# EAGLE design ledcube (EAGLE 6.5.0)
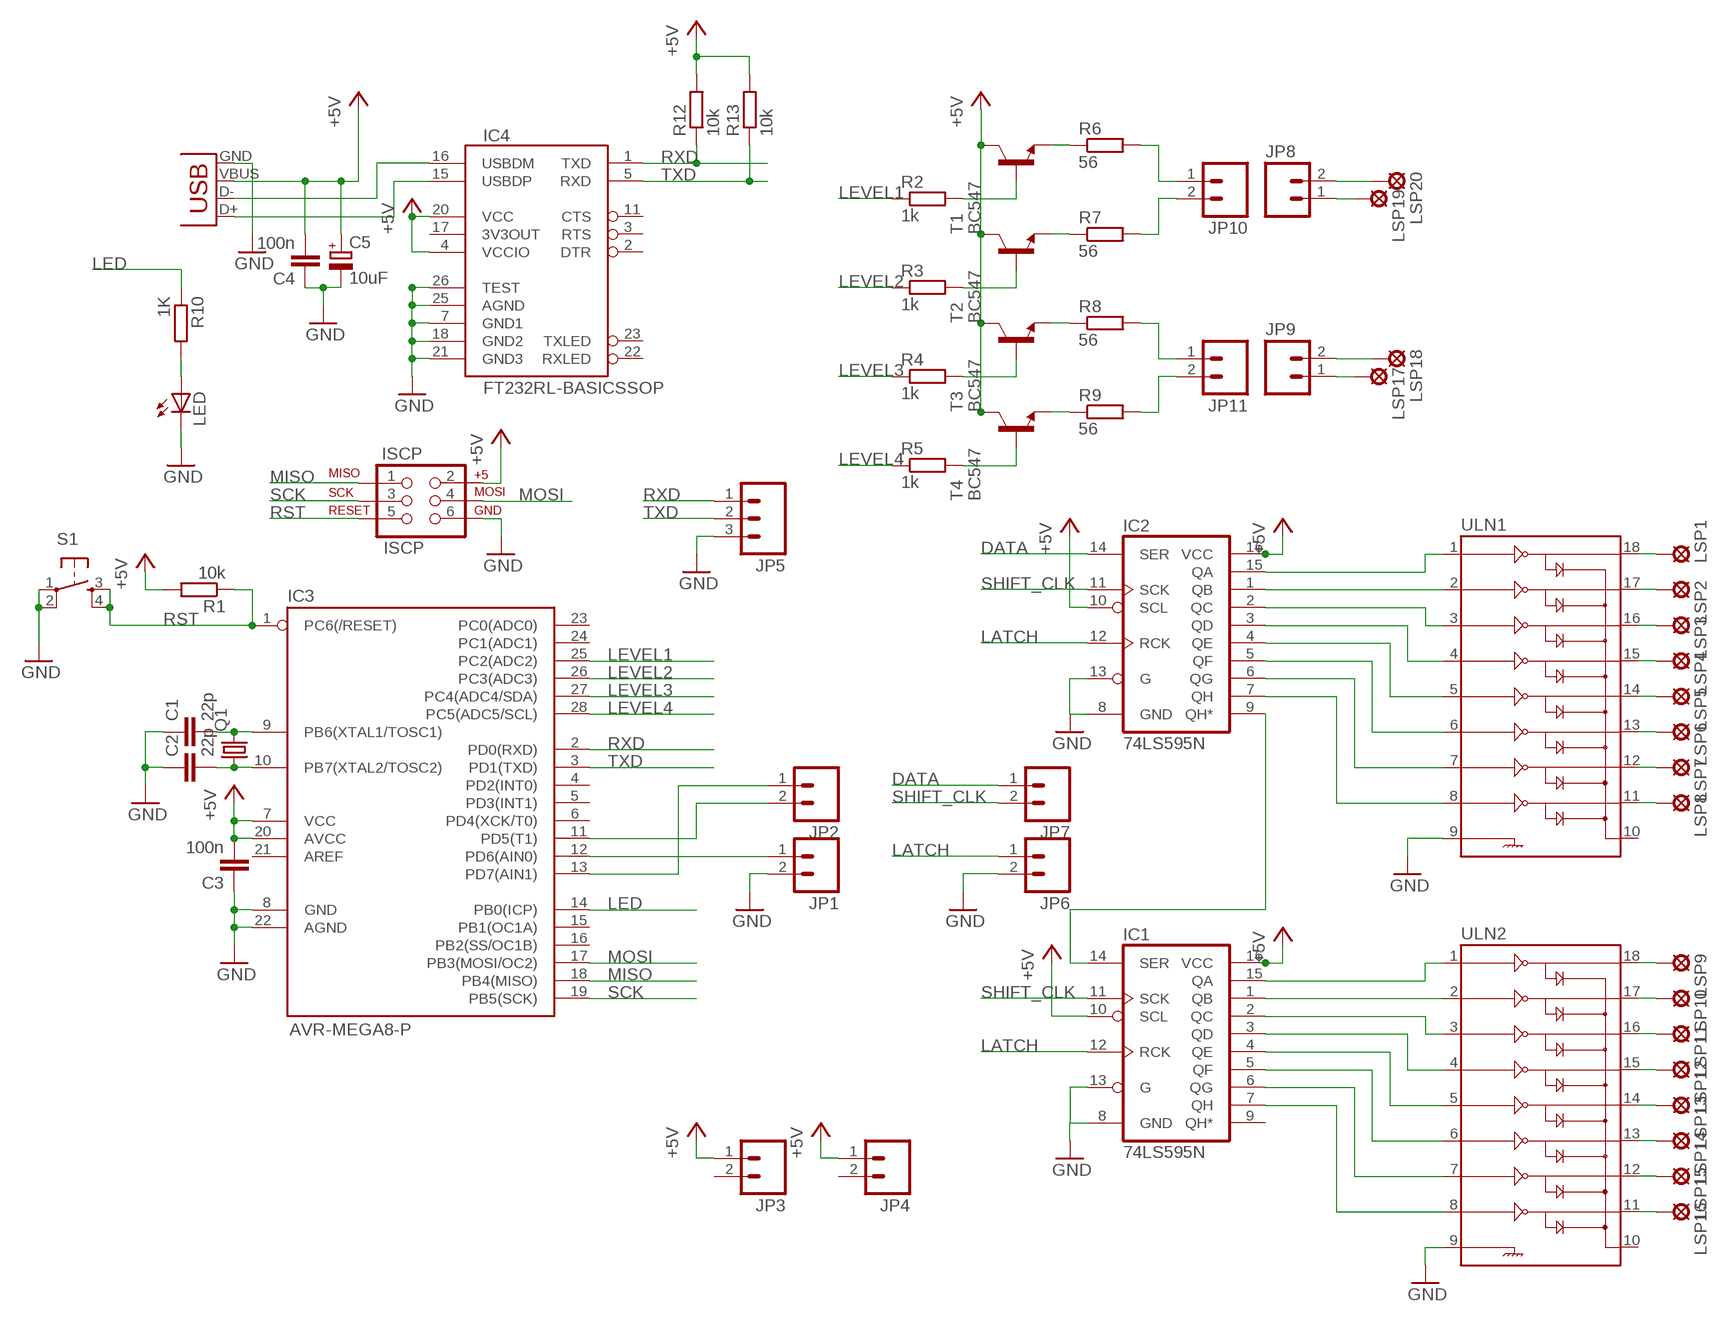
[diagram p0: schematic, sheet 1]

## Parts
C1  22p  C-EU050-024X044  [C050-024X044]
C2  22p  C-EU050-024X044  [C050-024X044]
C3  100n  C-EU050-024X044  [C050-024X044]
C4  100n  C-EU050-024X044  [C050-024X044]
C5  10uF  CPOL-EUE2.5-6  [E2,5-6]
IC1  74LS595N  [DIL16]
IC2  74LS595N  [DIL16]
IC3  AVR-MEGA8-P  [DIL28-3]
IC4  FT232RL-BASICSSOP  [SSOP28DB]
ISCP  ISCP  AVR_SPI_PRG_6NS  [2X3-NS]
JP1  M02PTH3  [1X02_LONGPADS]
JP2  M02PTH3  [1X02_LONGPADS]
JP3  M02PTH3  [1X02_LONGPADS]
JP4  M02PTH3  [1X02_LONGPADS]
JP5  M03PTH  [1X03]
JP6  M02PTH3  [1X02_LONGPADS]
JP7  M02PTH3  [1X02_LONGPADS]
JP8  M02PTH3  [1X02_LONGPADS]
JP9  M02PTH3  [1X02_LONGPADS]
JP10  M02PTH3  [1X02_LONGPADS]
JP11  M02PTH3  [1X02_LONGPADS]
LED  LED3MM  [LED3MM]
LSP1  LSP10  [LSP10]
LSP2  LSP10  [LSP10]
LSP3  LSP10  [LSP10]
LSP4  LSP10  [LSP10]
LSP5  LSP10  [LSP10]
LSP6  LSP10  [LSP10]
LSP7  LSP10  [LSP10]
LSP8  LSP10  [LSP10]
LSP9  LSP10  [LSP10]
LSP10  LSP10  [LSP10]
LSP11  LSP10  [LSP10]
LSP12  LSP10  [LSP10]
LSP13  LSP10  [LSP10]
LSP14  LSP10  [LSP10]
LSP15  LSP10  [LSP10]
LSP16  LSP10  [LSP10]
LSP17  LSP10  [LSP10]
LSP18  LSP10  [LSP10]
LSP19  LSP10  [LSP10]
LSP20  LSP10  [LSP10]
Q1  CRYSTALHC49S  [HC49/S]
R1  10k  R-EU_0204/2V  [0204V]
R2  1k  R-EU_0204/2V  [0204V]
R3  1k  R-EU_0204/2V  [0204V]
R4  1k  R-EU_0204/2V  [0204V]
R5  1k  R-EU_0204/2V  [0204V]
R6  56  R-EU_0204/2V  [0204V]
R7  56  R-EU_0204/2V  [0204V]
R8  56  R-EU_0204/2V  [0204V]
R9  56  R-EU_0204/2V  [0204V]
R10  1K  R-EU_0204/2V  [0204V]
R12  10k  R-EU_0204/2V  [0204V]
R13  10k  R-EU_0204/2V  [0204V]
S1  TAC_SWITCHPTH  [TACTILE-PTH]
T1  BC547  [TO92]
T2  BC547  [TO92]
T3  BC547  [TO92]
T4  BC547  [TO92]
ULN1  ULN2803DIP  [DIL18]
ULN2  ULN2803DIP  [DIL18]
X1  USBSMD  [USB-MINIB]

## Nets
+5V: C3.2 C4.2 C5.+ IC1.10(SCL) IC1.16(VCC) IC2.10(SCL) IC2.16(VCC) IC3.7(VCC) IC3.20(AVCC) IC4.4(VCCIO) IC4.20(VCC) ISCP.2 JP3.1 JP4.1 R1.2 R12.2 R13.2 T1.3(C) T2.3(C) T3.3(C) T4.3(C) X1.VBUS
DATA: IC2.14(SER) JP7.1
GND: C1.1 C2.1 C3.1 C4.1 C5.- IC1.8(GND) IC1.13(G) IC2.8(GND) IC2.13(G) IC3.8(GND) IC3.22(AGND) IC4.7(GND1) IC4.18(GND2) IC4.21(GND3) IC4.25(AGND) IC4.26(TEST) ISCP.6 JP1.2 JP5.3 JP6.2 LED.K(C) S1.1 S1.2 ULN1.9 ULN2.9 X1.GND
LATCH: IC1.12(RCK) IC2.12(RCK) JP6.1
LED: IC3.14(PB0(ICP)) R10.1
LEVEL1: IC3.25(PC2(ADC2)) R2.1
LEVEL2: IC3.26(PC3(ADC3)) R3.1
LEVEL3: IC3.27(PC4(ADC4/SDA)) R4.1
LEVEL4: IC3.28(PC5(ADC5/SCL)) R5.1
MISO: IC3.18(PB4(MISO)) ISCP.1
MOSI: IC3.17(PB3(MOSI/OC2)) ISCP.4
N$1: R6.1 T1.1(E)
N$2: R7.1 T2.1(E)
N$3: R8.1 T3.1(E)
N$4: R9.1 T4.1(E)
N$5: R5.2 T4.2(B)
N$6: R4.2 T3.2(B)
N$7: R3.2 T2.2(B)
N$8: R2.2 T1.2(B)
N$9: C2.2 IC3.10(PB7(XTAL2/TOSC2)) Q1.1
N$10: C1.2 IC3.9(PB6(XTAL1/TOSC1)) Q1.2
N$11: JP10.1 R6.2
N$12: IC4.16(USBDM) X1.D-
N$13: IC4.15(USBDP) X1.D+
N$14: IC1.15(QA) ULN2.1
N$15: IC1.1(QB) ULN2.2
N$16: IC1.2(QC) ULN2.3
N$17: IC1.3(QD) ULN2.4
N$18: IC1.4(QE) ULN2.5
N$19: IC1.5(QF) ULN2.6
N$20: IC1.6(QG) ULN2.7
N$21: IC1.7(QH) ULN2.8
N$22: IC2.15(QA) ULN1.1
N$23: IC2.1(QB) ULN1.2
N$24: IC2.2(QC) ULN1.3
N$25: IC2.3(QD) ULN1.4
N$26: IC2.4(QE) ULN1.5
N$27: IC2.5(QF) ULN1.6
N$28: IC2.6(QG) ULN1.7
N$29: IC2.7(QH) ULN1.8
N$30: JP9.1 LSP17.MP
N$31: JP11.1 R8.2
N$32: JP11.2 R9.2
N$33: IC3.11(PD5(T1)) JP2.2
N$34: IC3.12(PD6(AIN0)) JP1.1
N$35: IC3.13(PD7(AIN1)) JP2.1
N$36: JP10.2 R7.2
N$37: JP9.2 LSP18.MP
N$38: JP8.1 LSP19.MP
N$39: JP8.2 LSP20.MP
N$41: LSP16.MP ULN2.11
N$42: LSP15.MP ULN2.12
N$43: LSP14.MP ULN2.13
N$44: LSP13.MP ULN2.14
N$45: LSP12.MP ULN2.15
N$46: LSP11.MP ULN2.16
N$47: LSP10.MP ULN2.17
N$48: LSP9.MP ULN2.18
N$49: IC1.14(SER) IC2.9(QH*)
N$50: LED.A R10.2
N$55: LSP8.MP ULN1.11
N$56: LSP1.MP ULN1.18
N$57: LSP7.MP ULN1.12
N$58: LSP6.MP ULN1.13
N$59: LSP5.MP ULN1.14
N$60: LSP4.MP ULN1.15
N$61: LSP3.MP ULN1.16
N$62: LSP2.MP ULN1.17
RST: IC3.1(PC6(/RESET)) ISCP.5 R1.1 S1.3 S1.4
RXD: IC3.2(PD0(RXD)) IC4.1(TXD) JP5.1 R12.1
SCK: IC3.19(PB5(SCK)) ISCP.3
SHIFT_CLK: IC1.11(SCK) IC2.11(SCK) JP7.2
TXD: IC3.3(PD1(TXD)) IC4.5(RXD) JP5.2 R13.1
Unconnected: IC1.9(QH*) IC3.4(PD2(INT0)) IC3.5(PD3(INT1)) IC3.6(PD4(XCK/T0)) IC3.15(PB1(OC1A)) IC3.16(PB2(SS/OC1B)) IC3.21(AREF) IC3.23(PC0(ADC0)) IC3.24(PC1(ADC1)) IC4.2(DTR) IC4.3(RTS) IC4.11(CTS) IC4.17(3V3OUT) IC4.22(RXLED) IC4.23(TXLED) JP3.2 JP4.2 ULN1.10 ULN2.10

## Library data of the parts
C1-C4 = rcl:C-EU: CAPACITOR, European symbol
C5 = rcl:CPOL-EU: POLARIZED CAPACITOR, European symbol
IC1 IC2 = SparkFun:74*595: 8-bit SHIFT REGISTER, output latch
IC3 = SparkFun:AVR-MEGA8-P: MICROCONTROLLER 8 Kbytes FLASH 1 kbytes SRAM 512 bytes EEPROM USART 4-channel 10 bit ADC 2-channel 8 bit ADC
IC4 = SparkFun:FT232RL-BASIC: USB UART This is the simplified version of the FT232RL unit. Only what you need, nothing you don't. Spark Fun Electronics SKU : COM-00650
ISCP = SparkFun:AVR_SPI_PRG_6: AVR ISP 6 Pin This is the reduced ISP connector for AVR programming. Common on Arduino. This footprint will take up less PCB space and can be used with a 10-pin to 6-pin adapter such as SKU: BOB-08508
JP1-JP4 JP6-JP11 = SparkFun:M02: Header 2 Standard 2-pin 0.1" header. Use with straight break away headers (SKU : PRT-00116), right angle break away headers (PRT-00553), swiss pins (PRT-00743), machine pins (PRT-00117), and female headers (PRT-00115). Molex polarized connector foot print use with SKU : PRT-08233 with associated crimp pins and housings.
JP5 = SparkFun:M03: Header 3 Standard 3-pin 0.1" header. Use with straight break away headers (SKU : PRT-00116), right angle break away headers (PRT-00553), swiss pins (PRT-00743), machine pins (PRT-00117), and female headers (PRT-00115). Molex polarized connector foot print use with SKU : PRT-08232 with associated crimp pins and housings.
LED = led:LED: LED OSRAM: - CHIPLED LG R971, LG N971, LY N971, LG Q971, LY Q971, LO R971, LY R971 LH N974, LH R974 LS Q976, LO Q976, LY Q976 LO Q996 - Hyper CHIPLED LW Q18S LB Q993, LB Q99A, LB R99A - SideLED LS A670, LO A670, LY A670, LG A670, LP A670 LB A673, LV A673, LT A673, LW A673 LH A674 LY A675 LS A676, LA A676, LO A676, LY A676, LW A676 LS A679, LY A679, LG A679 - Hyper Micro SIDELED® LS Y876, LA Y876, LO Y876, LY Y876 LT Y87S - SmartLED LW L88C, LW L88S LB L89C, LB L89S, LG L890 LS L89K, LO L89K, LY L89K LS L896, LA L896, LO L896, LY L896 - TOPLED LS T670, LO T670, LY T670, LG T670, LP T670 LSG T670, LSP T670, LSY T670, LOP T670, LYG T670 LG T671, LOG T671, LSG T671 LB T673, LV T673, LT T673, LW T673 LH T674 LS T676, LA T676, LO T676, LY T676, LB T676, LH T676, LSB T676, LW T676 LB T67C, LV T67C, LT T67C, LS T67K, LO T67K, LY T67K, LW E67C LS E67B, LA E67B, LO E67B, LY E67B, LB E67C, LV E67C, LT E67C LW T67C LS T679, LY T679, LG T679 LS T770, LO T770, LY T770, LG T770, LP T770 LB T773, LV T773, LT T773, LW T773 LH T774 LS E675, LA E675, LY E675, LS T675 LS T776, LA T776, LO T776, LY T776, LB T776 LHGB T686 LT T68C, LB T68C - Hyper Mini TOPLED® LB M676 - Mini TOPLED Santana® LG M470 LS M47K, LO M47K, LY M47K Source: http://www.osram.convergy.de - LUMILED® LXK2-PW12-R00, LXK2-PW12-S00, LXK2-PW14-U00, LXK2-PW14-V00 LXK2-PM12-R00, LXK2-PM12-S00, LXK2-PM14-U00 LXK2-PE12-Q00, LXK2-PE12-R00, LXK2-PE12-S00, LXK2-PE14-T00, LXK2-PE14-U00 LXK2-PB12-K00, LXK2-PB12-L00, LXK2-PB12-M00, LXK2-PB14-N00, LXK2-PB14-P00, LXK2-PB14-Q00 LXK2-PR12-L00, LXK2-PR12-M00, LXK2-PR14-Q00, LXK2-PR14-R00 LXK2-PD12-Q00, LXK2-PD12-R00, LXK2-PD12-S00 LXK2-PH12-R00, LXK2-PH12-S00 LXK2-PL12-P00, LXK2-PL12-Q00, LXK2-PL12-R00 Source: www.luxeon.com
LSP1-LSP20 = solpad:LSP10: SOLDER PAD drill 1.0 mm, distributor Buerklin, 12H555
Q1 = crystal:CRYSTAL: CRYSTAL
R1-R10 R12 R13 = rcl:R-EU_: RESISTOR, European symbol
S1 = SparkFun:TAC_SWITCH: Momentary Switch Button commonly used for reset or general input. Spark Fun Electronics SKU : COM-00097
T1-T4 = transistor:BC547: NPN TRANSISTOR
ULN1 ULN2 = SparkFun:ULN2803: Darlington Driver ULN2803 Darlington array. 500mA max per channel, 8-channel package. Spark Fun Electronics SKU : COM-00312
X1 = SparkFun:USB: USB Connectors USB-B-PTH is fully proven SKU : PRT-00139 USB-miniB is fully proven SKU : PRT-00587 USB-A-PCB is untested. USB-A-H is throughly reviewed, but untested. Spark Fun Electronics SKU : PRT-00437 USB-B-SMT is throughly reviewed, but untested. Needs silkscreen touching up. USB-A-S has not been used/tested USB-MB-H has not been used/tested

## Board
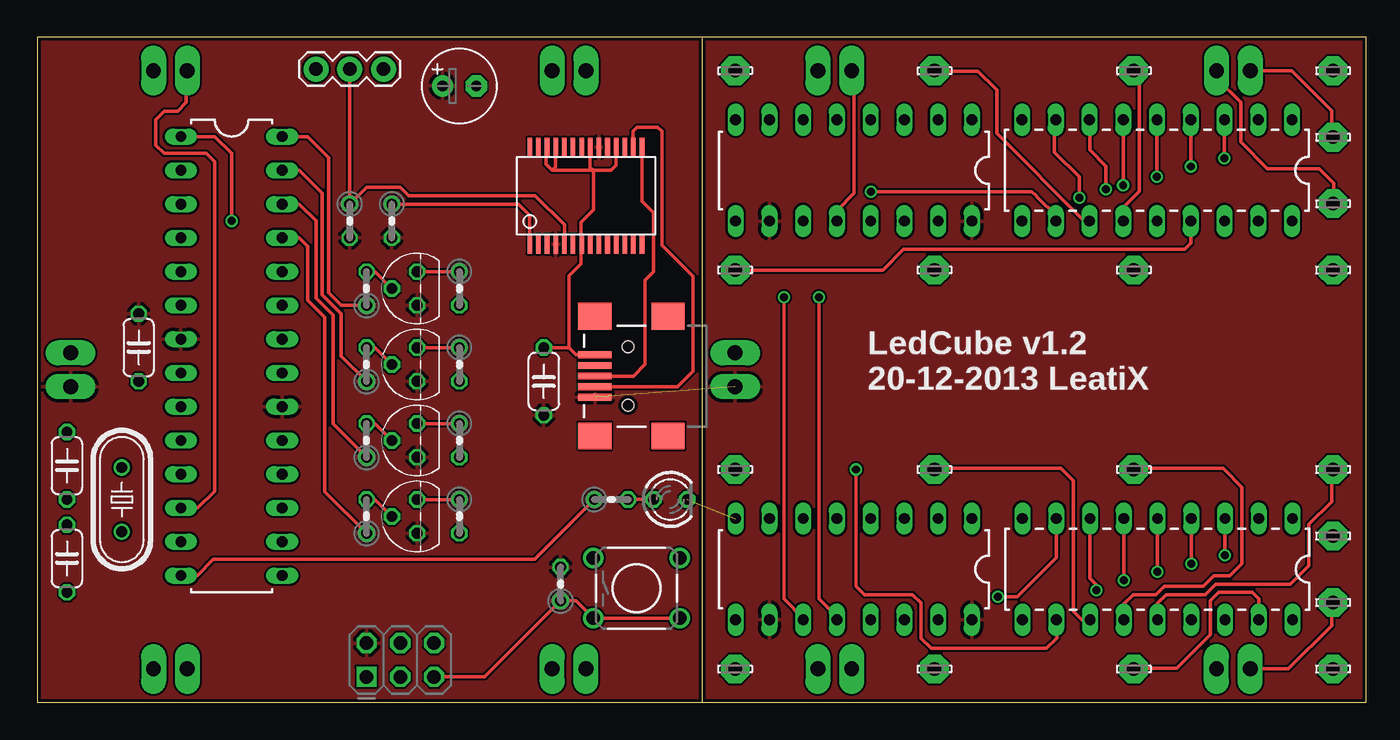
[diagram p1: board, top side]
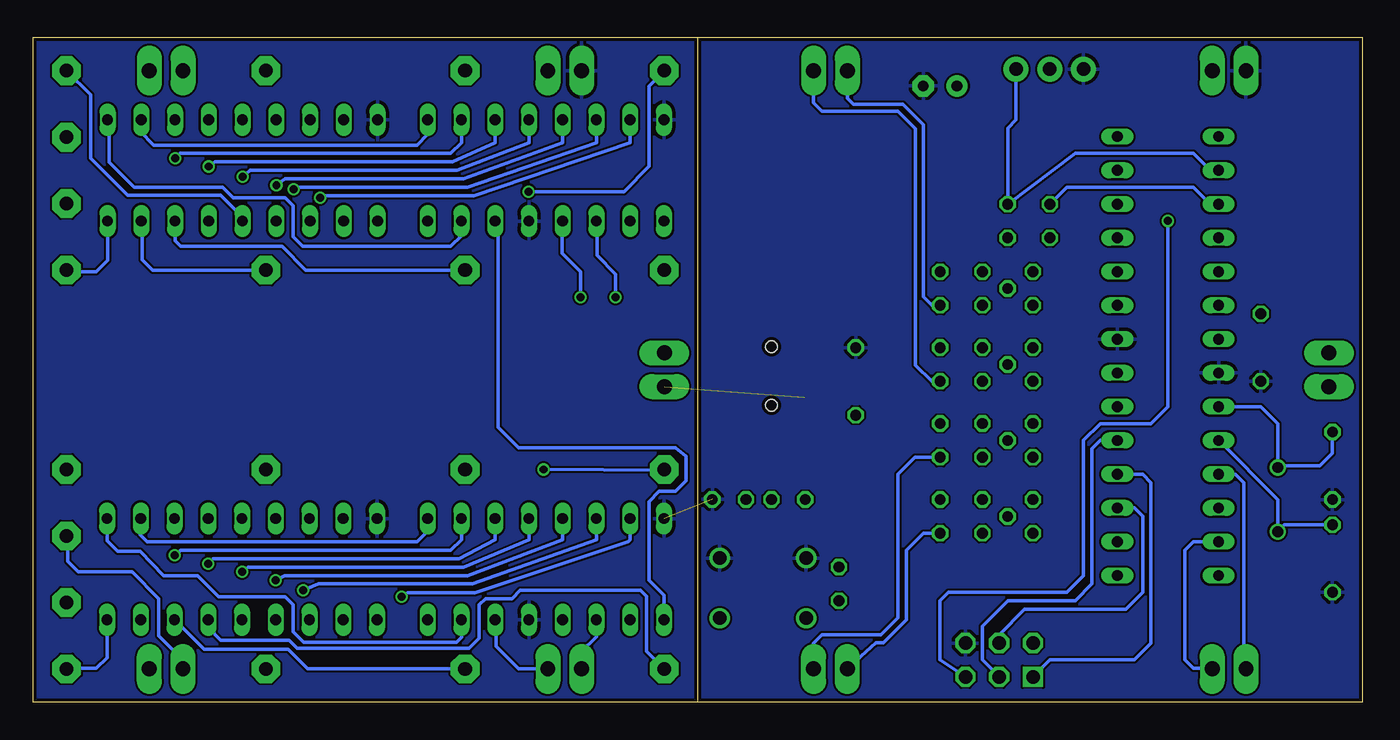
[diagram p2: board, bottom side, seen from below]

Size 100 x 50 mm. Coordinates in mm from the lower left corner, seen from the top.
Outline: 50,0 0,0 0,50 50,50
Outline: 50,0 100,0 100,50 50,50
Outline: 50,50 50,0
Copper layers (1*2*15*16): Top 0.035mm / dielectric 0.2mm / Route2 0.0175mm / dielectric 1.1mm / Route15 0.0175mm / dielectric 0.2mm / Bottom 0.035mm
Design rules "SeeedStudio_DRU_no_angle_20130527": minimum track width 6mil, minimum drill 12mil, track to track 6mil, track to pad 6mil, pad to pad 6mil, via to via 6mil, smd to smd 0mil, copper to edge 10mil, drill to drill 10mil, minimum pad ring 6mil, minimum via ring 6mil, stop-mask expansion 2mil, vias tented up to drill 25mil, thermal gap 10mil

### Footprints (pad centres in the part's own frame; a part is rotated, then mirrored left to right if it is on the bottom)
C050-024X044 = drill 0.813 octagon: 1 -2.54,0; 2 2.54,0
E2,5-6 = drill 0.813 pad 1.6: + -1.27,0 | drill 0.813 pad 1.6 octagon: - 1.27,0
DIL16 = drill 0.813 long: 1 -8.89,-3.81; 2 -6.35,-3.81; 3 -3.81,-3.81; 4 -1.27,-3.81; 5 1.27,-3.81; 6 3.81,-3.81; 7 6.35,-3.81; 8 8.89,-3.81; 9 8.89,3.81; 10 6.35,3.81; 11 3.81,3.81; 12 1.27,3.81; 13 -1.27,3.81; 14 -3.81,3.81; 15 -6.35,3.81; 16 -8.89,3.81
DIL28-3 = drill 0.813 long: 1 -16.51,-3.81; 2 -13.97,-3.81; 3 -11.43,-3.81; 4 -8.89,-3.81; 5 -6.35,-3.81; 6 -3.81,-3.81; 7 -1.27,-3.81; 8 1.27,-3.81; 9 3.81,-3.81; 10 6.35,-3.81; 11 8.89,-3.81; 12 11.43,-3.81; 13 13.97,-3.81; 14 16.51,-3.81; 15 16.51,3.81; 16 13.97,3.81; 17 11.43,3.81; 18 8.89,3.81; 19 6.35,3.81; 20 3.81,3.81; 21 1.27,3.81; 22 -1.27,3.81; 23 -3.81,3.81; 24 -6.35,3.81; 25 -8.89,3.81; 26 -11.43,3.81; 27 -13.97,3.81; 28 -16.51,3.81
SSOP28DB = smd 0.348 x 1.397: 1 -4.225,-3.656; 2 -3.575,-3.656; 3 -2.925,-3.656; 4 -2.275,-3.656; 5 -1.625,-3.656; 6 -0.975,-3.656; 7 -0.325,-3.656; 8 0.325,-3.656; 9 0.975,-3.656; 10 1.625,-3.656; 11 2.275,-3.656; 12 2.925,-3.656; 13 3.575,-3.656; 14 4.225,-3.656; 15 4.225,3.656; 16 3.575,3.656; 17 2.925,3.656; 18 2.275,3.656; 19 1.625,3.656; 20 0.975,3.656; 21 0.325,3.656; 22 -0.325,3.656; 23 -0.975,3.656; 24 -1.625,3.656; 25 -2.275,3.656; 26 -2.925,3.656; 27 -3.575,3.656; 28 -4.225,3.656
2X3-NS = drill 1.016 square: 1 -2.54,-1.27 | drill 1.016 octagon: 2 -2.54,1.27; 3 0,-1.27; 4 0,1.27; 5 2.54,-1.27; 6 2.54,1.27
1X02_LONGPADS = drill 1.118 pad 1.88 long: 1 0,0; 2 2.54,0
1X03 = drill 1.016 pad 1.88: 1 0,0; 2 2.54,0; 3 5.08,0
LED3MM = drill 0.813 octagon: A -1.27,0; K 1.27,0
LSP10 = drill 1.016 pad 2.159 octagon: MP 0,0
HC49/S = drill 0.813: 1 -2.413,0; 2 2.413,0
0204V = drill 0.813 octagon: 1 -1.27,0; 2 1.27,0
TACTILE-PTH = drill 1.016: 1 -3.251,2.261; 2 3.251,2.261; 3 -3.251,-2.261; 4 3.251,-2.261
TO92 = drill 0.813 octagon: 1 1.27,0; 2 0,1.905; 3 -1.27,0
DIL18 = drill 0.813 long: 1 -10.16,-3.81; 2 -7.62,-3.81; 3 -5.08,-3.81; 4 -2.54,-3.81; 5 0,-3.81; 6 2.54,-3.81; 7 5.08,-3.81; 8 7.62,-3.81; 9 10.16,-3.81; 10 10.16,3.81; 11 7.62,3.81; 12 5.08,3.81; 13 2.54,3.81; 14 0,3.81; 15 -2.54,3.81; 16 -5.08,3.81; 17 -7.62,3.81; 18 -10.16,3.81
USB-MINIB = smd 2.5 x 0.5: D+ 2.5,0; D- 2.5,0.8; GND 2.5,-1.6; ID 2.5,-0.8; VBUS 2.5,1.6 | smd 2.5 x 2: GND@1 -3,-4.5; GND@2 -3,4.5; GND@3 2.5,4.5; GND@4 2.5,-4.5 | hole 0.9: 0,2.2; 0,-2.2

### Placement (x,y rotation side)
C1  2.22,17.78 90 top
C2  2.22,10.79 90 top
C3  7.62,26.67 90 top
C4  38.1,24.13 270 top
C5  31.75,46.35 0 top
IC1  61.43,40 180 top
IC2  61.43,10 180 top
IC3  14.61,26.04 270 top
IC4  41.27,38.1 0 top
ISCP  27.3,3.17 0 top
JP1  11.27,47.5 180 top
JP2  11.27,2.5 180 top
JP3  52.5,23.73 90 top
JP4  2.5,23.73 90 top
JP5  26.04,47.62 180 top
JP6  61.27,47.5 180 top
JP7  61.27,2.5 180 top
JP8  88.73,2.5 0 top
JP9  91.27,47.5 180 top
JP10  38.73,2.5 0 top
JP11  41.27,47.5 180 top
LED  47.62,15.25 0 top
LSP1  97.5,2.5 0 top
LSP2  82.5,2.5 0 top
LSP3  67.5,2.5 0 top
LSP4  52.5,2.5 0 top
LSP5  97.5,17.5 0 top
LSP6  82.5,17.5 0 top
LSP7  67.5,17.5 0 top
LSP8  52.5,17.5 0 top
LSP9  97.5,32.5 0 top
LSP10  82.5,32.5 0 top
LSP11  67.5,32.5 0 top
LSP12  52.5,32.5 0 top
LSP13  97.5,47.5 0 top
LSP14  82.5,47.5 0 top
LSP15  67.5,47.5 0 top
LSP16  52.5,47.5 0 top
LSP17  97.5,42.5 0 top
LSP18  97.5,37.5 0 top
LSP19  97.5,12.5 0 top
LSP20  97.5,7.5 0 top
Q1  6.35,15.24 90 top
R1  39.37,8.89 90 top
R2  24.77,13.97 90 top
R3  24.77,19.68 90 top
R4  24.77,25.4 90 top
R5  24.77,31.11 90 top
R6  31.75,13.97 270 top
R7  31.75,19.68 270 top
R8  31.75,25.4 270 top
R9  31.75,31.11 270 top
R10  43.18,15.25 0 top
R12  26.67,36.2 270 top
R13  23.5,36.2 270 top
S1  45.09,8.57 0 top
T1  28.57,13.97 90 top
T2  28.57,19.68 90 top
T3  28.57,25.4 90 top
T4  28.57,31.11 90 top
ULN1  84.29,10 180 top
ULN2  84.25,40 180 top
X1  44.45,24.53 180 top

### Tracks (layer width: path | path; a pad name or v marks a point on that pad's centre or on a via)
+5V  (1 unrouted)
  pour Top: -1.27,50.8 100.33,50.8 100.33,-0.64 -1.27,-0.64
DATA
  Bottom 0.254: JP7.1 63.48,2.5 65.19,4.2 65.19,6.14 IC2.14
GND  (1 unrouted)
  Top 0.254: IC4.18 43.55,40.38 43.18,40.01 41.85,40.01 | 41.85,40.01 38.72,40.01 | 38.72,40.01 38.27,40.45 38.27,41.68 IC4.26 | IC4.25 39,40.29 38.72,40.01 | IC4.21 41.6,40.26 41.85,40.01 | 41.85,40.01 41.85,37.03 40.92,36.09 40.92,34.48 IC4.7 40.92,34.41 40.92,32.98 40.01,32.07 40.01,26.67 | X1.GND 40.55,26.13 40.01,26.67 | C4.1 40.01,26.67
  pour Bottom: -1.27,50.8 100.33,50.8 100.33,-0.64 -1.27,-0.64
LATCH  (via drill 0.6)
  Top 0.254: IC2.12 60.16,6.43 58.81,7.78 v58.81,30.45 | IC1.12 60.16,36.98 61.45,38.27 61.45,47.32 JP6.1
  Bottom 0.254: v58.81,30.45 58.81,32.36 60.21,33.76 60.21,36.14 IC1.12
LED
  Top 0.254: IC3.14 12.01,9.53 13.22,10.73 37.4,10.73 R10.1
LEVEL1
  Top 0.254: IC3.25 19.68,34.92 20.32,34.29 20.32,30.24 21.62,28.94 21.62,15.84 R2.1
LEVEL2
  Top 0.254: IC3.26 19.68,37.47 20.95,36.2 20.95,30.39 22.25,29.09 22.25,20.93 R3.1
LEVEL3
  Top 0.254: IC3.27 19.68,40.01 21.42,38.27 21.42,30.65 22.86,29.21 22.86,26.04 R4.1
LEVEL4
  Top 0.254: IC3.28 20.32,42.55 21.9,40.96 21.9,30.8 22.86,29.84 R5.1
MISO
  Bottom 0.254: IC3.18 16.51,17.14 15.88,16.51 15.88,4.45 17.14,3.17 23.5,3.17 ISCP.1
MOSI
  Bottom 0.254: IC3.17 17.14,14.61 16.51,13.97 16.51,8.26 17.78,6.99 25.4,6.99 27.3,5.08 ISCP.4
N$1
  Top 0.254: T1.1 R6.1
N$2
  Top 0.254: T2.1 R7.1
N$3
  Top 0.254: T3.1 R8.1
N$4
  Top 0.254: T4.1 R9.1
N$5
  Top 0.254: R5.2 25.4,32.38 T4.2
N$6
  Top 0.254: R4.2 25.4,26.67 T3.2
N$7
  Top 0.254: R3.2 25.4,20.95 T2.2
N$8
  Top 0.254: R2.2 25.4,15.24 T1.2
N$9
  Bottom 0.254: C2.2 5.84,13.34 Q1.1 6.35,15.24 IC3.10
N$10
  Bottom 0.254: IC3.9 7.62,22.23 6.35,20.95 Q1.2 6.22,17.78 3.17,17.78 2.22,18.73 C1.2
N$11
  Bottom 0.254: R6.2 33.02,12.7 34.29,11.43 34.29,6.19 36.03,4.46 36.59,4.46 38.08,3.11 38.69,2.54 JP10.1
N$12
  Top 0.254: X1.D- 48.16,23.73 49.32,24.89 49.32,32.05 46.98,34.38 46.98,42.94 46.67,43.25 45.12,43.25 44.81,42.94 44.81,41.8 IC4.16
N$13
  Top 0.254: X1.D+ 44.85,24.53 45.72,25.4 45.72,31.75 46.35,32.38 46.35,36.83 45.5,37.69 IC4.15
N$14
  Bottom 0.254: IC1.15 67.78,35.09 68.58,34.29 79.72,34.29 80.43,35 80.43,37.34 81.06,37.96 84.95,37.96 85.72,38.73 92.41,38.74 94.28,40.6 94.28,43.68 ULN2.1
N$15
  Bottom 0.254: IC1.1 70.32,42.71 71.12,41.91 90.92,41.91 91.94,42.94 91.94,43.73 ULN2.2
N$16  (via drill 0.6)
  Top 0.254: v89.3,40.92 89.3,43.78 ULN2.3
  Bottom 0.254: IC1.2 67.78,42.08 68.58,41.27 88.94,41.27 v89.3,40.92
N$17  (via drill 0.6)
  Top 0.254: v86.8,40.29 ULN2.4
  Bottom 0.254: IC1.3 65.24,42.08 68.42,40.64 86.31,40.64 v86.8,40.29
N$18  (via drill 0.6)
  Top 0.254: v84.25,39.52 ULN2.5
  Bottom 0.254: IC1.4 62.7,42.08 68.1,40.01 83.68,40.01 v84.25,39.52
N$19  (via drill 0.6)
  Top 0.254: v81.7,38.89 ULN2.6
  Bottom 0.254: IC1.5 60.16,42.08 67.62,39.37 81.05,39.37 v81.7,38.89
N$20  (via drill 0.6)
  Top 0.254: v80.42,38.58 80.42,40.31 79.19,41.54 ULN2.7
  Bottom 0.254: IC1.6 57.62,42.08 67.3,38.73 80.27,38.73 v80.42,38.58
N$21  (via drill 0.6)
  Top 0.254: v78.41,37.96 78.41,39.52 76.54,41.38 76.54,43.72 ULN2.8
  Bottom 0.254: IC1.7 55.08,42.08 66.82,38.1 78.07,38.1 v78.41,37.96
N$22
  Bottom 0.254: IC2.15 67.78,4.87 68.14,4.51 79.65,4.51 80.43,5.29 80.43,7.31 81.06,7.93 86.04,7.93 87.63,9.53 90.17,9.53 91.94,11.36 93.66,11.36 94.43,12.13 94.43,13.79 ULN1.1
N$23
  Bottom 0.254: IC2.1 70.32,12.87 71.12,12.06 91.41,12.06 91.94,12.6 91.94,13.78 ULN1.2
N$24  (via drill 0.6)
  Top 0.254: v89.37,11.05 ULN1.3
  Bottom 0.254: IC2.2 67.78,12.23 68.58,11.43 88.92,11.43 v89.37,11.05
N$25  (via drill 0.6)
  Top 0.254: v86.83,10.42 ULN1.4
  Bottom 0.254: IC2.3 65.24,12.23 67.94,10.79 86.44,10.79 v86.83,10.42
N$26  (via drill 0.6)
  Top 0.254: v84.29,9.8 ULN1.5
  Bottom 0.254: IC2.4 62.7,12.23 67.62,10.16 83.82,10.16 v84.29,9.8
N$27  (via drill 0.6)
  Top 0.254: v81.75,9.18 ULN1.6
  Bottom 0.254: IC2.5 60.16,12.23 67.31,9.53 81.09,9.53 v81.75,9.18
N$28  (via drill 0.6)
  Top 0.254: v79.68,8.4 79.68,8.85 79.19,9.34 ULN1.7
  Bottom 0.254: IC2.6 57.62,12.23 66.95,8.89 78.53,8.89 v79.68,8.4
N$29  (via drill 0.6)
  Top 0.254: ULN1.8 76.67,10.86 73.74,7.93 v72.28,7.93
  Bottom 0.254: IC2.7 55.08,12.23 55.24,12.06 66.74,8.24 71.81,8.24 v72.28,7.93
N$30
  Top 0.254: JP9.1 94.38,47.5 97.39,44.49 97.39,42.61 LSP17.MP
N$31
  Bottom 0.254: R8.2 32.38,24.13 33.6,25.36 33.6,43.13 34.92,44.45 40.64,44.45 41.27,45.09 JP11.1
N$32
  Bottom 0.254: R9.2 32.38,29.84 33.02,30.48 33.02,43.44 34.54,44.96 38.27,44.96 38.74,45.43 JP11.2
N$33
  Bottom 0.254: IC3.11 9.53,17.14 8.89,16.51 8.89,2.66 JP2.2
N$34
  Top 0.254: IC3.12 12.06,14.61 13.34,15.88 13.34,40.64 12.7,41.27 9.53,41.27 8.89,41.91 8.89,43.81 9.53,44.45 10.54,44.45 11.2,45.12 11.2,47.43 JP1.1
N$35
  Bottom 0.254: IC3.13 12.7,12.06 13.34,11.43 13.34,3.17 12.7,2.54 11.31,2.54 JP2.1
N$36
  Bottom 0.254: R7.2 33.66,18.41 34.92,17.14 34.92,6.35 36.2,5.08 40.64,5.08 41.27,4.45 JP10.2
N$37
  Top 0.254: JP9.2 88.73,46.93 90.55,45.12 90.55,42.16 92.57,40.14 96.46,40.14 97.55,39.05 97.55,37.55 LSP18.MP
N$38
  Bottom 0.254: JP8.1 88.73,3.16 90.55,4.98 90.55,7.78 92.57,9.8 96.61,9.8 97.39,10.58 97.39,12.39 LSP19.MP
N$39
  Top 0.254: JP8.2 94.13,2.5 97.39,5.76 97.39,7.39 LSP20.MP
N$41  (via drill 0.6)
  Top 0.254: ULN2.11 76.63,36.63 75.3,37.96 75.14,38.12 74.85,38.41 v62.71,38.41
  Bottom 0.254: v62.71,38.41 55.56,38.41 53.67,40.29 53.67,46.33 LSP16.MP
N$42
  Top 0.254: ULN2.12 78.78,36.19 72.19,42.78 72.19,46.05 70.79,47.45 67.55,47.45 LSP15.MP
N$43
  Top 0.254: ULN2.13 81.71,37.22 82.92,38.43 82.92,47.08 LSP14.MP
N$44
  Bottom 0.254: ULN2.14 84.25,36.49 85.88,38.12 92.88,38.12 95.68,40.92 95.68,45.68 LSP13.MP
N$45
  Top 0.254: LSP12.MP 63.62,32.5 65.19,34.07 86.34,34.07 86.81,34.54 86.81,36.17 ULN2.15
N$46
  Bottom 0.254: LSP11.MP 79.49,32.5 81.28,34.29 88.9,34.29 89.3,34.69 89.3,36.16 ULN2.16
N$47
  Bottom 0.254: LSP10.MP 91,32.5 91.79,33.29 91.79,36.11 ULN2.17
N$48
  Bottom 0.254: ULN2.18 94.41,33.23 95.25,32.38 97.39,32.38 LSP9.MP
N$49
  Bottom 0.254: IC2.9 52.54,8.05 53.67,9.18 53.67,15.09 52.9,15.87 51.65,15.87 50.87,16.65 50.87,18.51 51.65,19.14 63.48,19.14 65.03,20.69 65.03,35.98 IC1.14
N$50
  Top 0.254: R10.2 LED.A
N$55  (via drill 0.6)
  Top 0.254: v61.6,17.5 61.59,8.72 62.23,8.09 65.86,8.09 66.48,7.47 66.48,4.82 67.26,4.04 75.92,4.04 76.7,4.82 76.7,6.16 ULN1.11
  Bottom 0.254: v61.6,17.5 52.57,17.43 LSP8.MP
N$56
  Bottom 0.254: ULN1.18 94.45,3.34 95.25,2.54 97.46,2.54 LSP1.MP
N$57
  Top 0.254: ULN1.12 78.6,6.19 77.94,6.84 77.94,16.65 77.01,17.58 67.58,17.58 LSP7.MP
N$58
  Top 0.254: ULN1.13 81.75,7.38 82.45,8.09 84.17,8.09 84.79,8.71 87.74,8.71 88.52,9.49 89.72,9.49 90.65,10.42 90.65,16.18 89.25,17.58 82.58,17.58 LSP6.MP
N$59
  Top 0.254: ULN1.14 84.29,7.44 84.94,8.09 87.9,8.09 88.68,8.87 94.28,8.87 95.68,10.27 95.68,13.38 97.39,15.09 97.39,17.39 LSP5.MP
N$60
  Bottom 0.254: LSP4.MP 53.83,3.83 53.83,7.95 54.3,8.41 63.34,8.41 63.98,7.78 65.96,7.78 66.43,7.31 66.43,4.82 67.21,4.04 80.12,4.04 80.74,4.67 85.88,4.67 86.81,5.6 86.81,6.17 ULN1.15
N$61
  Bottom 0.254: LSP3.MP 79.33,2.5 80.8,3.97 87.15,3.97 ULN1.16
N$62
  Top 0.254: ULN1.17 91.91,7.79 91.44,8.26 88.9,8.26 88.27,7.62 88.27,5.08 85.72,2.54 82.54,2.54 LSP2.MP
RST  (via drill 0.6)
  Top 0.254: S1.4 S1.3 40.53,7.62 R1.1 33.66,1.91 ISCP.5 | v14.61,36.2 14.61,41.27 13.34,42.55 IC3.1
  Bottom 0.254: ISCP.5 31.75,3.17 31.75,7.62 31.11,8.26 22.23,8.26 20.95,9.53 20.95,19.68 19.68,20.95 15.88,20.95 14.61,22.23 v14.61,36.2
RXD
  Top 0.254: IC4.1 37.05,36.61 36.2,37.47 R12.1
  Bottom 0.254: IC3.2 11.43,40.01 12.7,41.27 21.59,41.27 R12.1 26.67,43.18 26.04,43.81 JP5.1
SCK
  Bottom 0.254: IC3.19 19.68,19.68 20.32,19.05 20.32,8.89 21.59,7.62 26.67,7.62 28.57,5.71 28.57,3.17 ISCP.3
SHIFT_CLK  (via drill 0.6)
  Top 0.254: IC2.11 57.62,6.32 56.16,7.78 v56.16,30.45
  Bottom 0.254: IC2.11 57.62,4.92 58.81,3.73 58.81,2.58 JP7.2 | v56.16,30.45 56.16,32.2 57.56,33.6 57.56,36.13 IC1.11
TXD
  Top 0.254: IC4.5 39.67,34.47 39.67,35.89 37.47,38.1 27.94,38.1 27.3,38.73 24.77,38.73 R13.1 23.5,38.74 23.49,40.64 23.5,41.91 JP5.2
  Bottom 0.254: IC3.3 11.43,37.47 12.7,38.73 22.23,38.73 R13.1

### Text on the board
tNames: LedCube v1.2 / 20-12-2013 LeatiX